# EAGLE design Sensor (EAGLE 7.1.0)
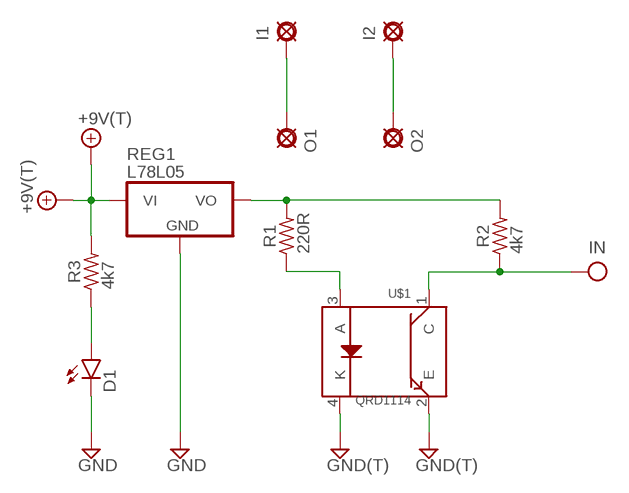
[diagram p0: schematic, sheet 1]

## Parts
+9V  +9V(T)  [SQUARE]
+9V1  +9V(T)  [SQUARE]
D1  LED3MM  [LED3MM]
G  GND(T)  [SQUARE]
G2  GND(T)  [SQUARE]
I1  PAD  [SQUARE]
I2  PAD  [SQUARE]
IN  OUT(T)  [SQUARE]
O1  PAD  [SQUARE]
O2  PAD  [SQUARE]
R1  220R  6MM.3  [R0207/3]
R2  4k7  6MM.3  [R0207/3]
R3  4k7  6MM.3  [R0207/3]
REG1  L78L05  7805  [TO92-]
U$1  QRD1114  [QRD1114]

## Nets
+9V: +9V1.1(+9V) +9V.1(+9V) R3.2 REG1.1(VI)
GND: D1.K(C) G2.1(GND) G.1(GND) REG1.2(GND) U$1.2(E) U$1.4(K)
N$1: R1.2 R2.2 REG1.3(VO)
N$2: R1.1 U$1.3(A)
N$3: D1.A R3.1
N$4: I1.1(PAD) O1.1(PAD)
N$5: I2.1(PAD) O2.1(PAD)
OUT: IN.1(OUT) R2.1 U$1.1(C)

## Library data of the parts
+9V +9V1 = mb_supply:+9V(T): +9V Voltage Supply use this to hook up +9v throughout a schematic instead of running wire automatically labels the net "+9v" adds a hookup pad to the circuit board
D1 = mb_diodes:LED
G G2 = mb_supply:GND(T): Ground use this to hook up ground (GND) throughout a schematic instead of running wire automatically labels the net "GND" adds a hookup pad to the circuit board (you can use several)
I1 I2 O1 O2 = mb_supply:PAD: PAD use this package for pads with any purpose, including input, output, send or return various pad shapes: round, square, octogonal, long, and long offset
IN = mb_supply:OUT(T): Output obsolete: use Pad instead and label net output label with circuit board terminal/pad usually appears only once on a schematic
R1-R3 = mb_resistors:6MM: 6mm Resistors Leads spaced 1-6 holes apart for 0.1" perfboard. Suitable for 1/4 watt resistors.
REG1 = mb_regulators:7805
U$1 = Sensors:QRD1114

## Board
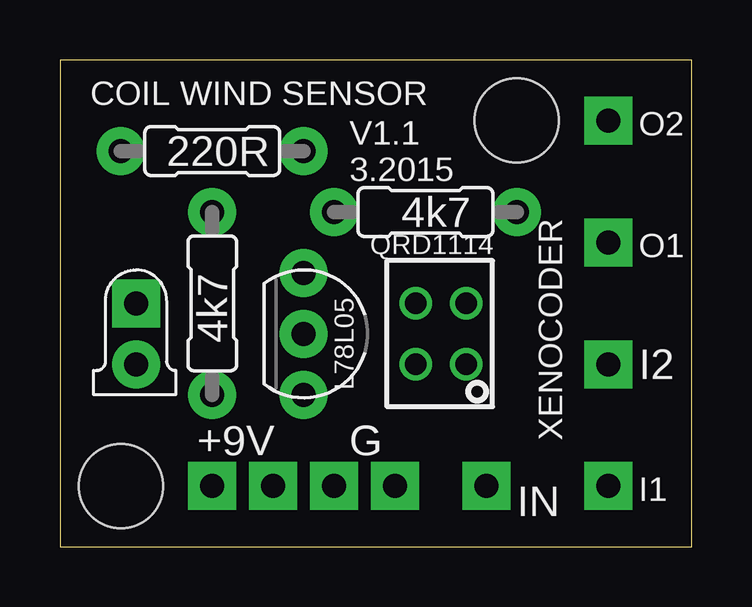
[diagram p1: board, top side]
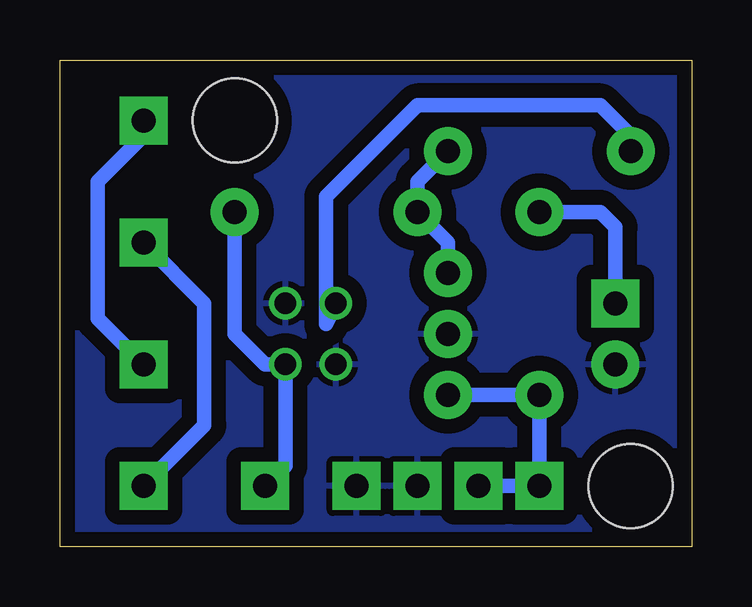
[diagram p2: board, bottom side, seen from below]

Size 26.34 x 20.31 mm. Coordinates in mm from the lower left corner, seen from the top.
Outline: 0,0 26.34,0 26.34,20.31 0,20.31 0,0
Copper layers (1*16): Top 0.0356mm / dielectric 1.5011mm / Bottom 0.0356mm
Design rules "LaenPCBOrder": minimum track width 6mil, minimum drill 13mil, track to track 6mil, track to pad 6mil, pad to pad 6mil, via to via 6mil, smd to smd 6mil, copper to edge 15mil, drill to drill 6mil, minimum pad ring 7mil, minimum via ring 7mil, stop-mask expansion 3mil, vias tented up to drill 0mil, thermal gap 10mil
Holes 3.51 mm at 2.54,2.54 19.05,17.78

### Footprints (pad centres in the part's own frame; a part is rotated, then mirrored left to right if it is on the bottom)
SQUARE = drill 1 pad 2 square: 1 0,0
LED3MM = drill 1 pad 2 square: A -1.27,0 | drill 1 pad 2: K 1.27,0
R0207/3 = drill 1 pad 2: 1 -3.81,0; 2 3.81,0
TO92- = drill 1 pad 2: 1 -2.54,0; 2 0,0; 3 2.54,0
QRD1114 = drill 0.9: 1 -1.067,1.27; 2 -1.067,-1.27; 3 1.041,-1.27; 4 1.041,1.27

### Placement (x,y rotation side)
+9V  6.35,2.54 0 top
+9V1  8.89,2.54 0 top
D1  3.17,8.89 270 top
G  13.97,2.54 0 top
G2  11.43,2.54 0 top
I1  22.86,2.54 0 top
I2  22.86,7.62 0 top
IN  17.78,2.54 0 top
O1  22.86,12.7 0 top
O2  22.86,17.78 0 top
R1  6.35,16.51 0 top
R2  15.24,13.97 180 top
R3  6.35,10.16 270 top
REG1  10.16,8.89 90 top
U$1  15.88,8.89 180 top

### Tracks (layer width: path | path; a pad name or v marks a point on that pad's centre or on a via)
+9V
  Bottom 0.61: REG1.1 R3.2 +9V.1 +9V1.1
GND
  pour Bottom (isolate 0.61): 0,20.32 26.04,20.32 26.04,0 0,0
N$1
  Bottom 0.61: R1.2 11.43,15.24 R2.2 10.16,12.7 REG1.3
N$2
  Bottom 0.61: R1.1 2.54,17.14 3.81,18.41 11.43,18.41 15.24,14.61 15.24,9.3 U$1.3
N$3
  Bottom 0.61: D1.A 3.17,13.34 3.81,13.97 R3.1
N$4
  Bottom 0.61: I1.1 20.32,5.08 20.32,10.16 O1.1
N$5
  Bottom 0.61: I2.1 24.77,9.53 24.77,15.24 22.86,17.14 O2.1
OUT
  Bottom 0.61: IN.1 16.94,3.38 U$1.1 17.78,7.62 19.05,8.89 R2.1

### Text on the board
tNames: COIL WIND SENSOR | V1.1 / 3.2015 | XENOCODER